# Altium schematic sheet Power.SchDoc
size A4
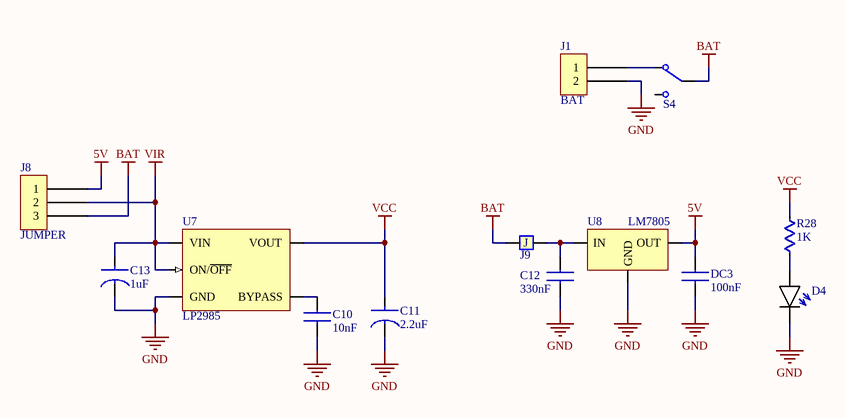
[diagram p0: Power.SchDoc]

## Parts
C10  value 10nF  [C1206]  (hidden comment: CAP-CER)
C11  value 2.2uF  [CAP-ELEC-5x11x2mm]  (hidden comment: CAP-ELEC)
C12  value 330nF  [C1206]  (hidden comment: CAP-CER)
C13  value 1uF  [CAP-ELEC-5x11x2mm]  (hidden comment: CAP-ELEC)
D4  LED  [LED-3MM-RED]  (value not drawn)
DC3  value 100nF  [C1206]  (hidden comment: CAP-CER)
J1  BAT  [HEADER 1x2]
J8  JUMPER  [Header 1x3]
J9  JUMPER  [JUMPER]  (value not drawn)
R28  value 1K  [R1206]  (hidden comment: RES)
S4  SLIDE-SWITCH  [SWITCH]  (value not drawn)
U7  LP2985  [SOT-23-5]
U8  LM7805  [TO-220-FLAT]

## Nets
5V: DC3.2 J8.1 U8.3(OUT)
BAT: J8.3 J9.2 S4.2
GND: C10.1 C11.2 C12.2 C13.2 D4.K DC3.1 J1.2 U7.2(GND) U8.2(GND)
VCC: C11.1 R28.2 U7.5(VOUT)
VIR: C13.1 J8.2 U7.1(VIN) U7.3(ON/~{OFF})
NetC10_2: C10.2 U7.4(BYPASS)
NetC12_1: C12.1 J9.1 U8.1(IN)
NetD4_A: D4.A R28.1
NetJ1_1: J1.1 S4.1

Not connected (* = marked no-connect by the designer): S4 3

## Notes on the sheet
- (in symbol JUMPER) J

## Library data of the parts
J1 = Header 1x2
J8 = Header 1x3
U8 = LM78XX